# EAGLE design eclet (EAGLE 6.4)
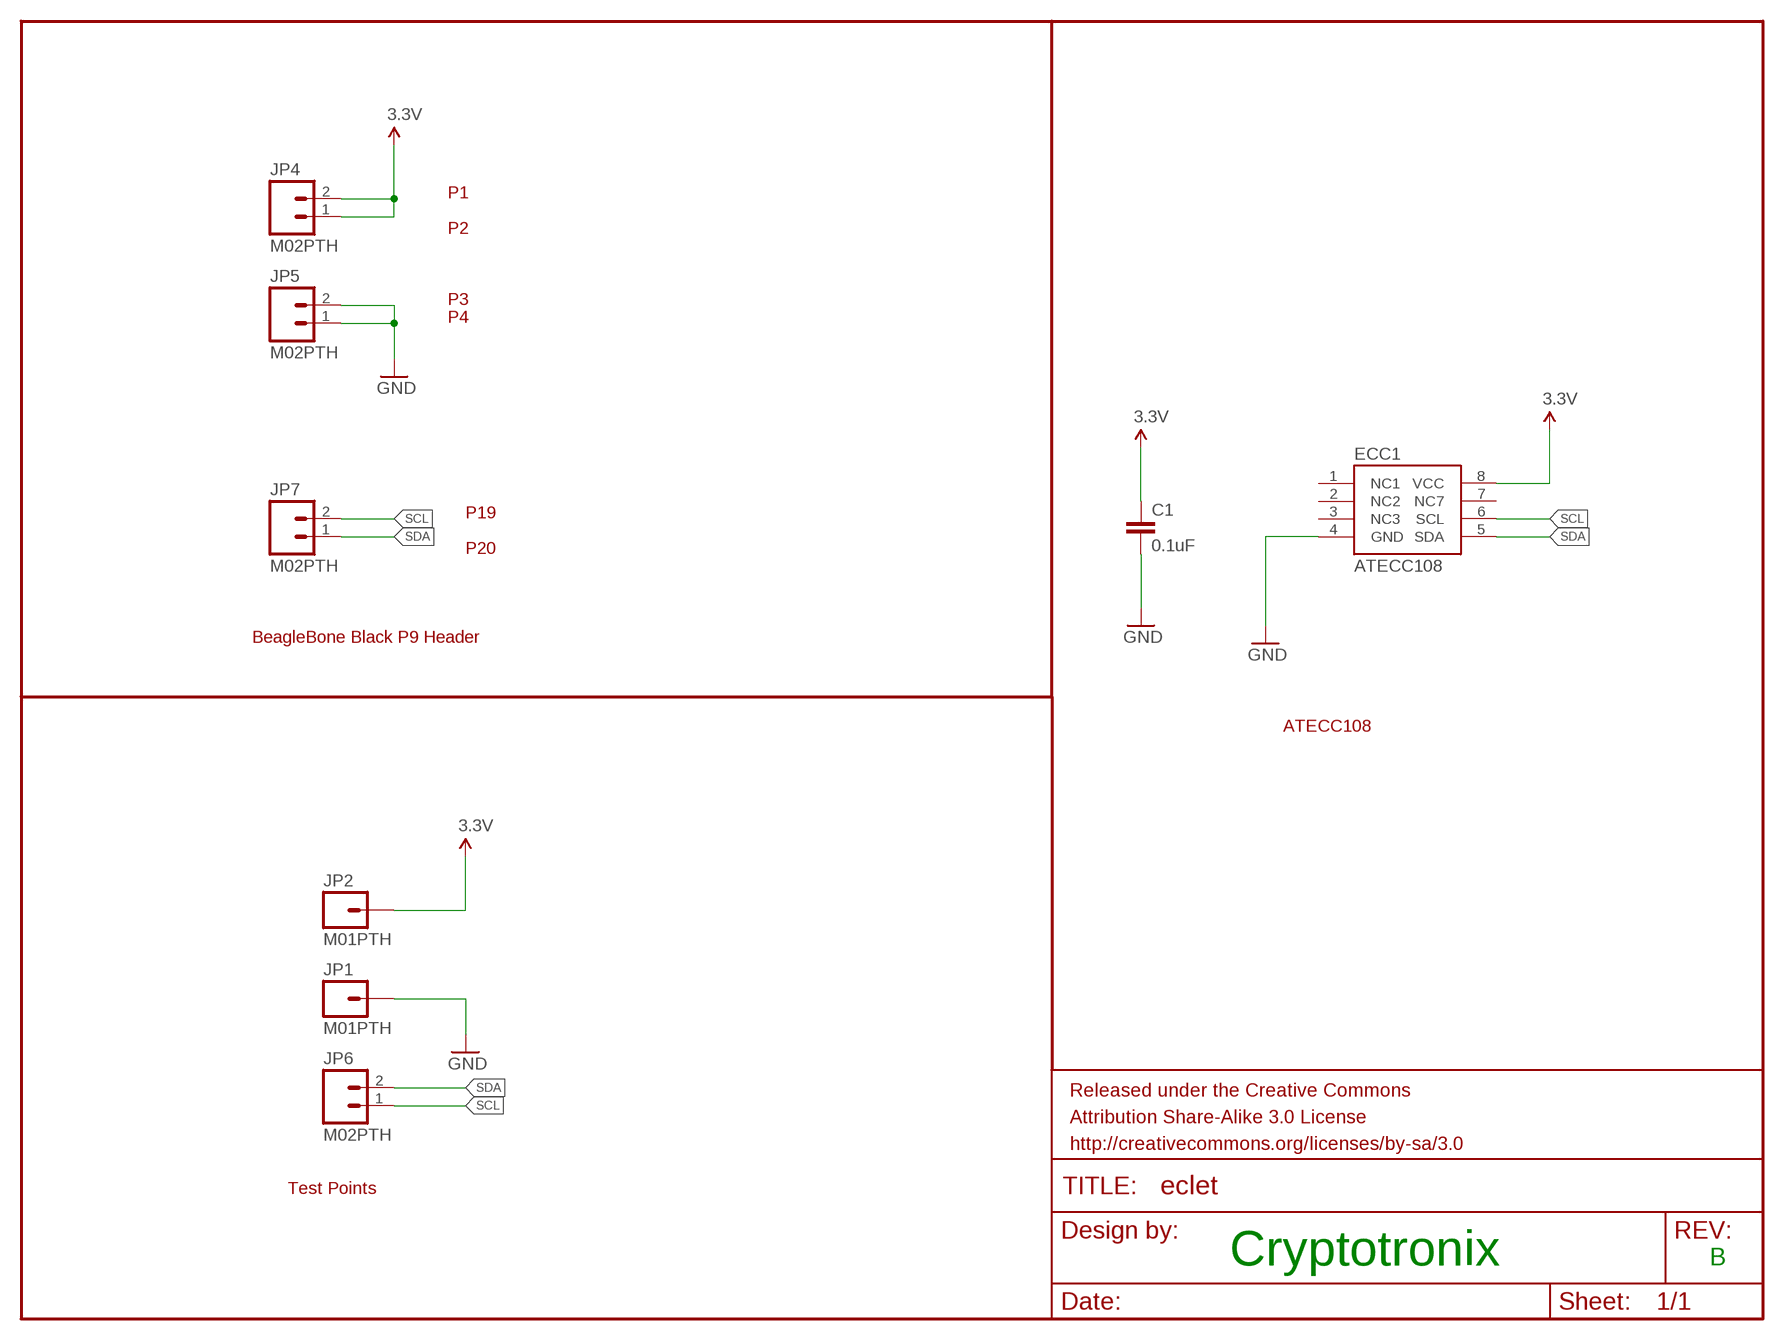
[diagram p0: schematic, sheet 1]

## Parts
C1  0.1uF  0.1UF-100V-10%(0603)  [0603-CAP]
ECC1  ATECC108  [SOIC8]
FRAME1  FRAME-LETTER  [CREATIVE_COMMONS]
JP1  M01PTH  [1X01]
JP2  M01PTH  [1X01]
JP4  M02PTH  [1X02]
JP5  M02PTH  [1X02]
JP6  M02PTH  [1X02]
JP7  M02PTH  [1X02]

## Nets
3.3V: C1.1 ECC1.8(VCC) JP2.1 JP4.1 JP4.2
GND: C1.2 ECC1.4(GND) JP1.1 JP5.1 JP5.2
SCL: ECC1.6(SCL) JP6.1 JP7.2
SDA: ECC1.5(SDA) JP6.2 JP7.1
Unconnected: ECC1.1(NC1) ECC1.2(NC2) ECC1.3(NC3) ECC1.7(NC7)

## Notes on the sheet
- P1
- P2
- P3
- P4
- P19
- P20
- BeagleBone Black P9 Header
- ATECC108
- Test Points
- Cryptotronix | B

## Library data of the parts
C1 = SparkFun-Capacitors:0.1UF-100V-10%(0603): CAP-08390; PROD_ID: CAP-08390
ECC1 = cryptotronix:ATECC108: ATECC108: Provides ECDSA with NIST curves P256, B283, and K283. Also, a RNG, 8.5Kb EEPROM. 2.0V - 5.5V.
FRAME1 = SparkFun-Aesthetics:FRAME-LETTER: Schematic Frame Standard 8.5x11 US Letter frame
JP1 JP2 = SparkFun-Connectors:M01: Header 1 Standard 1-pin 0.1" header. Use with straight break away headers (SKU : PRT-00116), right angle break away headers (PRT-00553), swiss pins (PRT-00743), machine pins (PRT-00117), and female headers (PRT-00115).
JP4-JP7 = SparkFun-Connectors:M02: Standard 2-pin 0.1" header. Use with - straight break away headers ( PRT-00116) - right angle break away headers (PRT-00553) - swiss pins (PRT-00743) - machine pins (PRT-00117) - female headers (PRT-00115) Molex polarized connector foot print use with: PRT-08233 with associated crimp pins and housings. 2.54_SCREWTERM for use with PRT-10571. 3.5mm Screw Terminal footprints for PRT-08084 5mm Screw Terminal footprints for use with PRT-08433

## Board
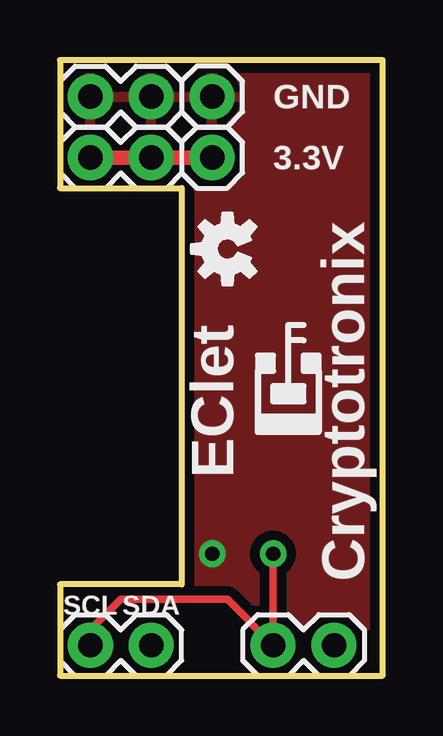
[diagram p1: board, top side]
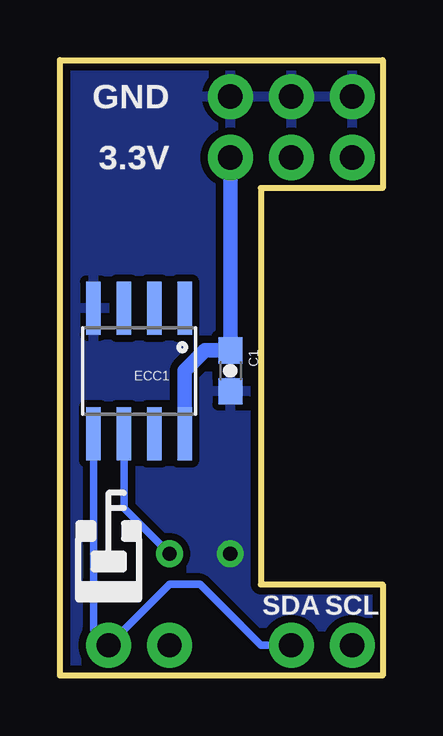
[diagram p2: board, bottom side, seen from below]

Size 13.46 x 25.65 mm. Coordinates in mm from the lower left corner, seen from the top.
Outline: 0,0 13.46,0 13.46,25.65 0,25.65 0,20.32 5.08,20.32 5.08,3.81 0,3.81 0,0
Copper layers (1*16): Top 0.035mm / dielectric 1.5mm / Bottom 0.035mm
Design rules "SparkFun": minimum track width 8mil, minimum drill 20mil, track to track 8mil, track to pad 8mil, pad to pad 8mil, via to via 8mil, smd to smd 8mil, copper to edge 10mil, drill to drill 8mil, minimum pad ring 12mil, minimum via ring 10mil, stop-mask expansion 4mil, vias tented up to drill 25mil, thermal gap 10mil

### Footprints (pad centres in the part's own frame; a part is rotated, then mirrored left to right if it is on the bottom)
0603-CAP = smd 1.1 x 1: 1 -0.85,0; 2 0.85,0
SOIC8 = smd 0.61 x 2.21: 1 -1.905,-2.616; 2 -0.635,-2.616; 3 0.635,-2.616; 4 1.905,-2.616; 5 1.905,2.616; 6 0.635,2.616; 7 -0.635,2.616; 8 -1.905,2.616
1X01 = drill 1.016 pad 1.88: 1 0,0
1X02 = drill 1.016 pad 1.88: 1 0,0; 2 2.54,0

### Placement (x,y rotation side)
C1  6.35,12.7 270 bottom
ECC1  10.16,12.7 180 bottom
FRAME1  19.05,-10.16 0 top  (outside the outline)
JP1  6.35,24.13 0 top
JP2  6.35,21.59 0 top
JP4  1.27,21.59 0 top
JP5  1.27,24.13 0 top
JP6  8.89,1.27 0 top
JP7  3.81,1.27 180 top
U$1  [OSHW-LOGO-S]  6.99,17.78 90 top

### Tracks (layer width: path | path; a pad name or v marks a point on that pad's centre or on a via)
3.3V
  Top 0.61: JP4.1 JP4.2 JP2.1
  Bottom 0.61: ECC1.8 8.26,12.7 7.41,13.55 C1.1 JP2.1
GND  (via drill 0.6)
  other vias: 6.35,5.08
  pour Top (isolate 0.406): -1.27,-2.54 16.51,-2.54 16.51,26.67 -1.27,26.67
  pour Bottom (isolate 0.305): -1.27,26.67 16.51,26.67 16.51,-2.54 -1.27,-2.54
SCL  (via drill 0.6)
  Top 0.305: JP7.2 1.27,1.91 2.54,3.17 6.99,3.17 JP6.1 v8.89,5.08
  Bottom 0.305: ECC1.6 10.79,6.99 v8.89,5.08
SDA
  Bottom 0.305: JP7.1 5.08,1.27 7.62,3.81 8.89,3.81 JP6.2 12.07,1.91 ECC1.5

### Text on the board
tPlace: GND | 3.3V | EClet | Cryptotronix | SCL | SDA
bPlace: GND | 3.3V | SCL | SDA
tDocu: Cryptotronix